# Altium schematic sheet 03_POWER.SchDoc
size A2; SheetNumber: 4; SheetTotal: 5
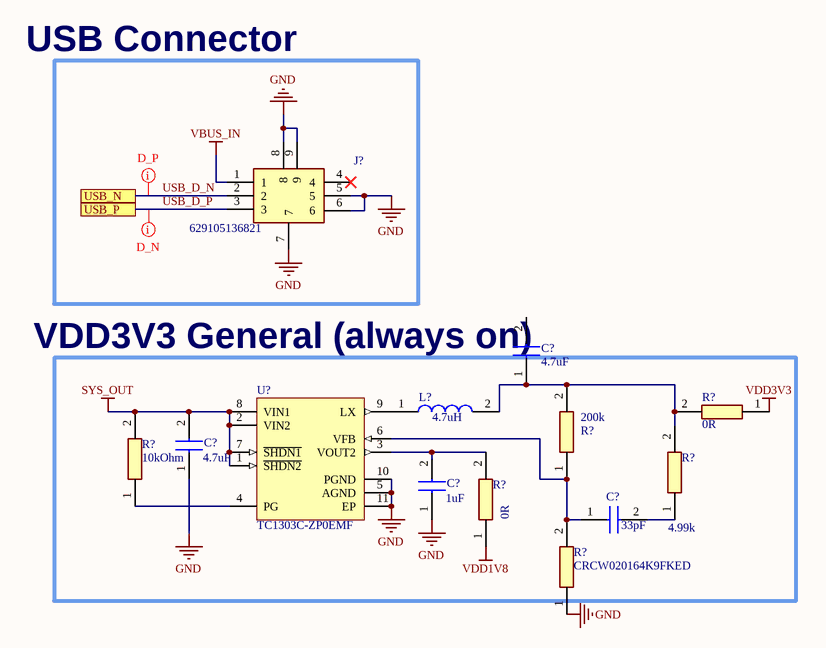
[diagram p0: 03_POWER.SchDoc]

## Parts
(Parts that share a designator on the sheet are numbered #1, #2 ... from top to bottom, then left to right.)
C?#1  value 4.7uF  [CAPC1006X65N]  (hidden comment: JMK105BBJ475MVHF)
C?#2  value 4.7uF  [CAPC1006X65N]  (hidden comment: JMK105BBJ475MVHF)
C?#3  value 1uF  [GRM033D70J224ME01D]  (hidden comment: GRM033R61A105ME44J)
C?#4  value 33pF  [C0402C104J4RACTU]  (hidden comment: C0402C330J5GAC)
J?  629105136821  [MICRO-USB(2.0-SMT-TYPE-B)]
L?  value 4.7uH  [LQM18FN100M00D]  (hidden comment: LQM18FN4R7M00D)
R?#1  value 0R  [RESC1005X40N]  (hidden comment: ERJ-S020R00X)
R?#2  value 200k  [RESC0603X28N]  (hidden comment: CRCW0201200KFKED)
R?#3  value 10kOhm  [RESC0603X28N]  (hidden comment: CRCW020110K0FKED)
R?#4  value 4.99k  [RESC0603X28N]  (hidden comment: CRCW02014K99FKED)
R?#5  value 0R  [RESC1005X40N]  (hidden comment: ERJ-S020R00X)
R?#6  CRCW020164K9FKED  [RESC0603X28N]
U?  TC1303C-ZP0EMF  [DFN-MF10]

## Blocks framed on the sheet
USB Connector: J?
VDD3V3 General (always on): C?#2-C?#4 L? R?#1-R?#6 U?

## Ports
USB_N, USB_P

## Nets
GND: C?#2.1 C?#3.1 J?.5 J?.6 J?.7 J?.8 J?.9 R?#6.1 U?.5(AGND) U?.10(PGND) U?.11(EP)
SYS_OUT: C?#2.2 R?#3.2 U?.1(~{SHDN2}) U?.2(VIN2) U?.7(~{SHDN1}) U?.8(VIN1)
VBUS_IN: J?.1
VDD1V8: R?#5.1
VDD3V3: R?#1.1
USB_D_N: J?.2 ; port USB_N
USB_D_P: J?.3 ; port USB_P
NetC?#1_1: C?#1.1 L?.2 R?#1.2 R?#2.2 R?#4.2
NetC?#3_2: C?#3.2 R?#5.2 U?.3(VOUT2)
NetC?#4_1: C?#4.1 R?#2.1 R?#6.2 U?.6(VFB)
NetC?#4_2: C?#4.2 R?#4.1
NetL?_1: L?.1 U?.9(LX)
NetR?#3_1: R?#3.1 U?.4(PG)

Not connected (* = marked no-connect by the designer): C?#1 2; J? 4*

## Layout directives
differential pair: USB_D_N, USB_D_P

## Library data of the parts
C?#1 C?#2 = JMK105BBJ475MVHF: Capacitor; Manufacturer_Name: TAIYO YUDEN; Datasheet Link: https://ds.yuden.co.jp/TYCOMPAS/ut/detail?pn=JMK105BBJ475MVHF &u=M; Height: 0.65mm; Manufacturer_Part_Number: JMK105BBJ475MVHF
C?#3 = GRM033R61A105ME44J: Capacitor; Manufacturer_Name: Murata Electronics; Datasheet Link: https://search.murata.co.jp/Ceramy/image/img/A01X/G101/ENG/GRM033R61A105ME44-04A.pdf; Height: 0.5mm; Manufacturer_Part_Number: GRM033R61A105ME44J
C?#4 = C0402C330J5GAC: Capacitor; Manufacturer_Name: KEMET; Datasheet Link: https://content.kemet.com/datasheets/KEM_C1002_X7R_SMD.pdf; Height: 0.55mm; Manufacturer_Part_Number: C0402C330J5GAC
J? = 629105136821: Connector; Manufacturer_Name: Wurth Elektronik; Datasheet Link: https://componentsearchengine.com/Datasheets/1/629105136821.pdf; Mouser2 Part Number: 710-629105136821; Mouser2 Price/Stock: https://www.mouser.com/Search/Refine.aspx?Keyword=710-629105136821; Manufacturer_Part_Number: 629105136821
L? = LQM18FN4R7M00D: Inductor; Manufacturer_Name: Murata Electronics; Datasheet Link: https://psearch.en.murata.com/inductor/product/LQM18FN4R7M00%23.html; Height: 0.9mm; Manufacturer_Part_Number: LQM18FN4R7M00D; Arrow Part Number: LQM18FN4R7M00D; Arrow Price/Stock: null?region=nac
R?#1 R?#5 = ERJ-S020R00X: Resistor; Manufacturer_Name: Panasonic; Datasheet Link: https://industrial.panasonic.com/cdbs/www-data/pdf/RDP0000/AOA0000C334.pdf; Height: 0.4mm; Manufacturer_Part_Number: ERJ-S020R00X; Mouser Part Number: 667-ERJ-S020R00X; Mouser Price/Stock: https://www.mouser.co.uk/ProductDetail/Panasonic/ERJ-S020R00X?qs=Zyl8A9hlmJqcGEcH0dtAYQ%3D%3D; Arrow Part Number: ERJ-S020R00X; Arrow Price/Stock: https://www.arrow.com/en/products/erj-s020r00x/panasonic?region=nac
R?#2 = CRCW0201200KFKED: Resistor; Manufacturer_Name: Vishay; Datasheet Link: http://www.vishay.com/docs/20035/dcrcwe3.pdf; Height: 0.28mm; Manufacturer_Part_Number: CRCW0201200KFKED; Arrow Part Number: CRCW0201200KFKED; Arrow Price/Stock: https://www.arrow.com/en/products/crcw0201200kfked/vishay
R?#3 = CRCW020110K0FKED: Resistor; Manufacturer_Name: Vishay; Datasheet Link: http://www.vishay.com/docs/20035/dcrcwe3.pdf; Height: 0.28mm; Manufacturer_Part_Number: CRCW020110K0FKED; Arrow Part Number: CRCW020110K0FKED; Arrow Price/Stock: https://www.arrow.com/en/products/crcw020110k0fked/vishay
R?#4 = CRCW02014K99FKED: Resistor; Manufacturer_Name: Vishay; Datasheet Link: http://www.vishay.com/docs/20035/dcrcwe3.pdf; Height: 0.28mm; Manufacturer_Part_Number: CRCW02014K99FKED; Arrow Part Number: CRCW02014K99FKED; Arrow Price/Stock: https://www.arrow.com/en/products/crcw02014k99fked/vishay
R?#6 = CRCW020164K9FKED: Resistor; Manufacturer_Name: Vishay; value: 64.9k; Datasheet Link: http://www.vishay.com/docs/20035/dcrcwe3.pdf; Height: 0.28mm; Manufacturer_Part_Number: CRCW020164K9FKED
U? = CMP-0139-00073-1: 500mA Synchronous Buck Regulator + 300mA LDO with Power-Good Output, Adjustable, 1.8V, 10-Pin DFN, Industrial Temperature; PackageVersion: revBB, Aug-2009; PackageDescription: 10-Lead Plastic Dual Flat, No Lead Package (MF) - 3x3x0.9mm Body [DFN]; PackageReference: DFN-MF10; DatasheetVersion: revB, Jul-2005